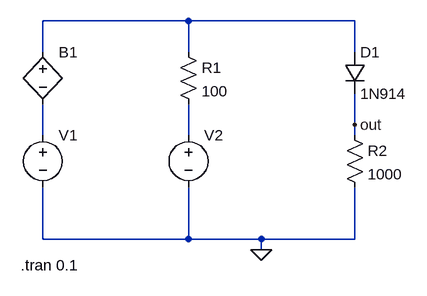
[diagram p0: schematic circuito4.asc]
circuito4.asc, the LTspice schematic file:
Version 4
SHEET 1 880 680
WIRE 256 0 32 0
WIRE 512 0 256 0
WIRE 32 48 32 0
WIRE 256 48 256 0
WIRE 512 48 512 0
WIRE 512 160 512 112
WIRE 32 176 32 128
WIRE 256 176 256 128
WIRE 512 176 512 160
WIRE 32 336 32 256
WIRE 256 336 256 256
WIRE 256 336 32 336
WIRE 368 336 256 336
WIRE 512 336 512 256
WIRE 512 336 368 336
WIRE 368 352 368 336
FLAG 368 352 0
FLAG 512 160 out
SYMBOL voltage 32 160 R0
WINDOW 3 24 96 Invisible 2
WINDOW 123 0 0 Left 0
SYMATTR InstName V1
SYMATTR Value SINE(0.5 0.2 1000)
SYMATTR SpiceLine Rser=50
SYMBOL bv 32 32 R0
WINDOW 3 24 96 Invisible 2
SYMATTR InstName B1
SYMATTR Value V=white(-1e3*time)/10 + white(1e3*time)/10
SYMBOL voltage 256 160 R0
WINDOW 3 24 96 Invisible 2
WINDOW 123 0 0 Left 0
SYMATTR InstName V2
SYMATTR Value SINE(0.5 0.2 1200)
SYMATTR SpiceLine Rser=50
SYMBOL res 240 32 R0
SYMATTR InstName R1
SYMATTR Value 100
SYMBOL diode 496 48 R0
SYMATTR InstName D1
SYMATTR Value 1N914
SYMBOL res 496 160 R0
SYMATTR InstName R2
SYMATTR Value 1000
TEXT -2 376 Left 2 !.tran 0.1

The netlist it stands for:
* circuito4.asc
V1 N002 0 SINE(0.5 0.2 1000) Rser=50
B1 N001 N002 V=white(-1e3*time)/10 + white(1e3*time)/10
V2 N003 0 SINE(0.5 0.2 1200) Rser=50
R1 N001 N003 100
D1 N001 out 1N914
R2 out 0 1000
.model D D
.lib standard.dio
.tran 0.1
.backanno
.end